# EAGLE design メイン2 (EAGLE 7.4.0)
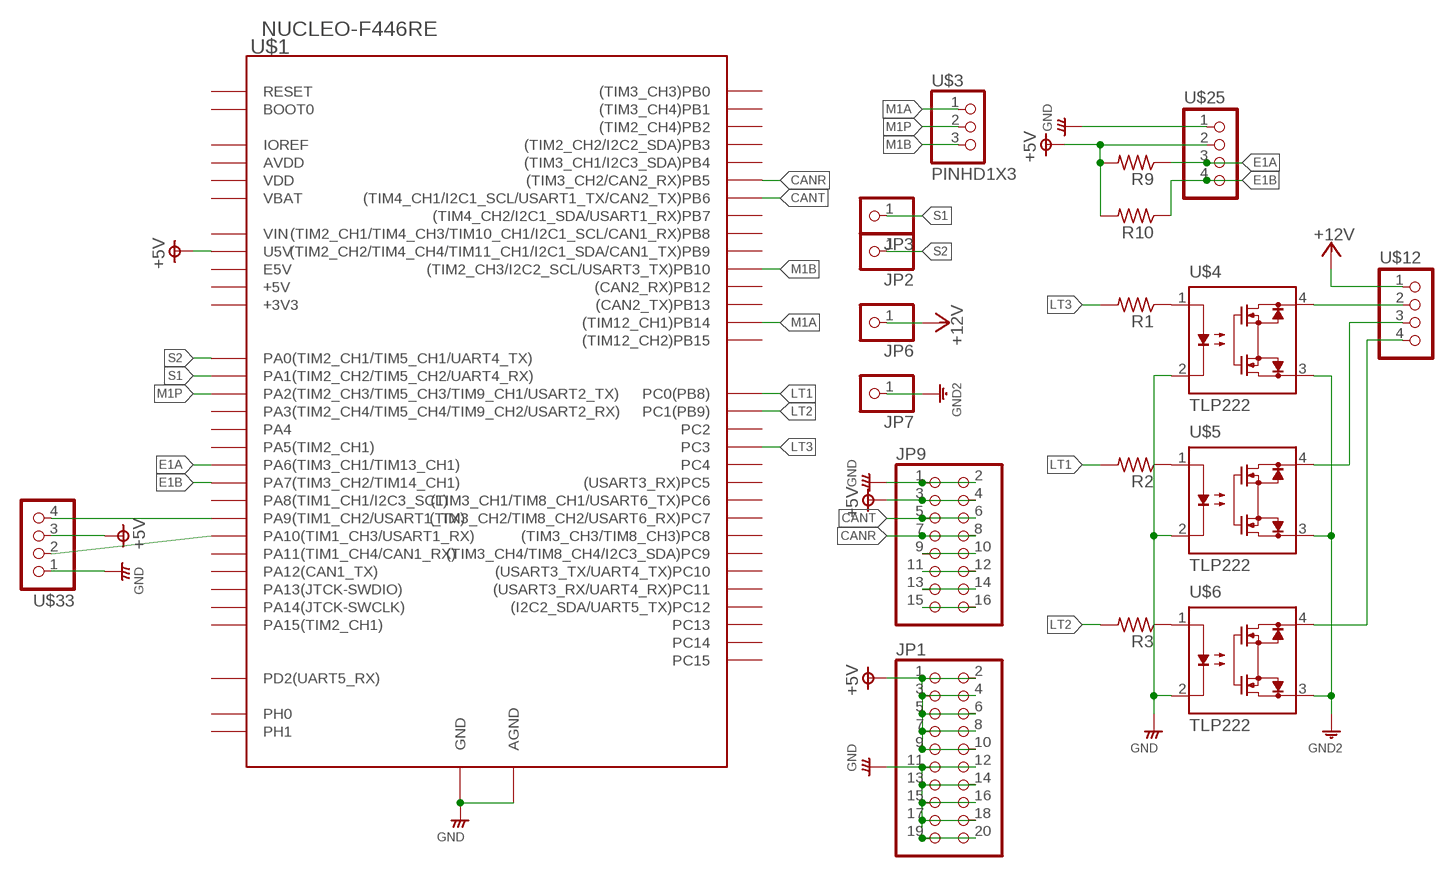
[diagram p0: schematic, sheet 1]

## Parts
JP1  PINHD-2X10  [2X10]
JP2  PINHD-1X1  [1X01]
JP3  PINHD-1X1  [1X01]
JP6  PINHD-1X1  [1X01]
JP7  PINHD-1X1  [1X01]
JP9  PINHD-2X8  [2X08]
R1  RESISTORS-3  [R_0.3]
R2  RESISTORS-3  [R_0.3]
R3  RESISTORS-3  [R_0.3]
R9  RESISTORS-3  [R_0.3]
R10  RESISTORS-3  [R_0.3]
U$1  NUCLEO-F446RE  [NUCLEO-F（L）ｘｘｘRｘ]
U$3  PINHD1X3  [1X3(XH)]
U$4  TLP222  [DIP4]
U$5  TLP222  [DIP4]
U$6  TLP222  [DIP4]
U$12  XH-PIN4  [XH-4PIN]
U$25  XH-PIN4  [XH-4PIN]
U$33  XH-PIN4  [XH-4PIN]

## Nets
+5V: JP1.1 JP1.2 JP1.3 JP1.4 JP1.5 JP1.6 JP1.7 JP1.8 JP1.9 JP1.10 JP9.3 JP9.4 R9.2 R10.2 U$1.U5V U$25.2 U$33.3
+12V: JP6.1 U$12.1
CANR: JP9.7 JP9.8 U$1.PB5((TIM3_CH2/CAN2_RX)PB5)
CANT: JP9.5 JP9.6 U$1.PB6((TIM4_CH1/I2C1_SCL/USART1_TX/CAN2_TX)PB6)
E1A: R9.1 U$1.PA6(PA6(TIM3_CH1/TIM13_CH1)) U$25.3
E1B: R10.1 U$1.PA7(PA7(TIM3_CH2/TIM14_CH1)) U$25.4
GND: JP1.11 JP1.12 JP1.13 JP1.14 JP1.15 JP1.16 JP1.17 JP1.18 JP1.19 JP1.20 JP9.1 JP9.2 U$1.AGND U$1.GND@1(GND) U$1.GND@2(GND) U$1.GND@3(GND) U$1.GND@4(GND) U$1.GND@5(GND) U$1.GND@6(GND) U$4.2(2CATHODE) U$5.2(2CATHODE) U$6.2(2CATHODE) U$25.1 U$33.1
GND12: JP7.1 U$4.3(3DRAIN) U$5.3(3DRAIN) U$6.3(3DRAIN) ; supply symbol labelled GND2
LT1: R2.2 U$1.PC0(PC0(PB8))
LT2: R3.2 U$1.PC1(PC1(PB9))
LT3: R1.2 U$1.PC3
M1A: U$1.PB14((TIM12_CH1)PB14) U$3.1
M1B: U$1.PB10((TIM2_CH3/I2C2_SCL/USART3_TX)PB10) U$3.3
M1P: U$1.PA2(PA2(TIM2_CH3/TIM5_CH3/TIM9_CH1/USART2_TX)) U$3.2
N$1: U$1.PA10(PA10(TIM1_CH3/USART1_RX)) U$33.2
N$3: U$1.PA9(PA9(TIM1_CH2/USART1_TX)) U$33.4
N$11: U$4.4(4DRAIN) U$12.2
N$12: U$5.4(4DRAIN) U$12.3
N$13: U$6.4(4DRAIN) U$12.4
N$19: JP9.9 JP9.10
N$20: JP9.11 JP9.12
N$21: JP9.13 JP9.14
N$22: JP9.15 JP9.16
N$39: R1.1 U$4.1(1ANODE)
N$40: R2.1 U$5.1(1ANODE)
N$41: R3.1 U$6.1(1ANODE)
S1: JP3.1 U$1.PA1(PA1(TIM2_CH2/TIM5_CH2/UART4_RX))
S2: JP2.1 U$1.PA0(PA0(TIM2_CH1/TIM5_CH1/UART4_TX))
Unconnected: U$1.+3V3 U$1.+5V U$1.AVDD U$1.BOOT0 U$1.E5V U$1.IOREF U$1.PA3(PA3(TIM2_CH4/TIM5_CH4/TIM9_CH2/USART2_RX)) U$1.PA4 U$1.PA5(PA5(TIM2_CH1)) U$1.PA8(PA8(TIM1_CH1/I2C3_SCL)) U$1.PA11(PA11(TIM1_CH4/CAN1_RX)) U$1.PA12(PA12(CAN1_TX)) U$1.PA13(PA13(JTCK-SWDIO)) U$1.PA14(PA14(JTCK-SWCLK)) U$1.PA15(PA15(TIM2_CH1)) U$1.PB0((TIM3_CH3)PB0) U$1.PB1((TIM3_CH4)PB1) U$1.PB2((TIM2_CH4)PB2) U$1.PB3((TIM2_CH2/I2C2_SDA)PB3) U$1.PB4((TIM3_CH1/I2C3_SDA)PB4) U$1.PB7((TIM4_CH2/I2C1_SDA/USART1_RX)PB7) U$1.PB8((TIM2_CH1/TIM4_CH3/TIM10_CH1/I2C1_SCL/CAN1_RX)PB8) U$1.PB9((TIM2_CH2/TIM4_CH4/TIM11_CH1/I2C1_SDA/CAN1_TX)PB9) U$1.PB12((CAN2_RX)PB12) U$1.PB13((CAN2_TX)PB13) U$1.PB15((TIM12_CH2)PB15) U$1.PC2 U$1.PC4 U$1.PC5((USART3_RX)PC5) U$1.PC6((TIM3_CH1/TIM8_CH1/USART6_TX)PC6) U$1.PC7((TIM3_CH2/TIM8_CH2/USART6_RX)PC7) U$1.PC8((TIM3_CH3/TIM8_CH3)PC8) U$1.PC9((TIM3_CH4/TIM8_CH4/I2C3_SDA)PC9) U$1.PC10((USART3_TX/UART4_TX)PC10) U$1.PC11((USART3_RX/UART4_RX)PC11) U$1.PC12((I2C2_SDA/UART5_TX)PC12) U$1.PC13 U$1.PC14 U$1.PC15 U$1.PD2(PD2(UART5_RX)) U$1.PH0 U$1.PH1 U$1.RESET U$1.VBAT U$1.VDD U$1.VIN

## Library data of the parts
JP1 = pinhead_s:PINHD-2X10: PIN HEADER
JP2 JP3 JP6 JP7 = pinhead_s:PINHD-1X1: PIN HEADER
JP9 = pinhead_s:PINHD-2X8: PIN HEADER
R1-R3 R9 R10 = rcl__s:RESISTORS
U$1 = STM32:NUCLEO-F446RE
U$3 = pinhead_s:PINHD1X3
U$4-U$6 = TLP222:TLP222
U$12 U$25 U$33 = xh-pin4:XH-PIN4: xh-pin4

## Board
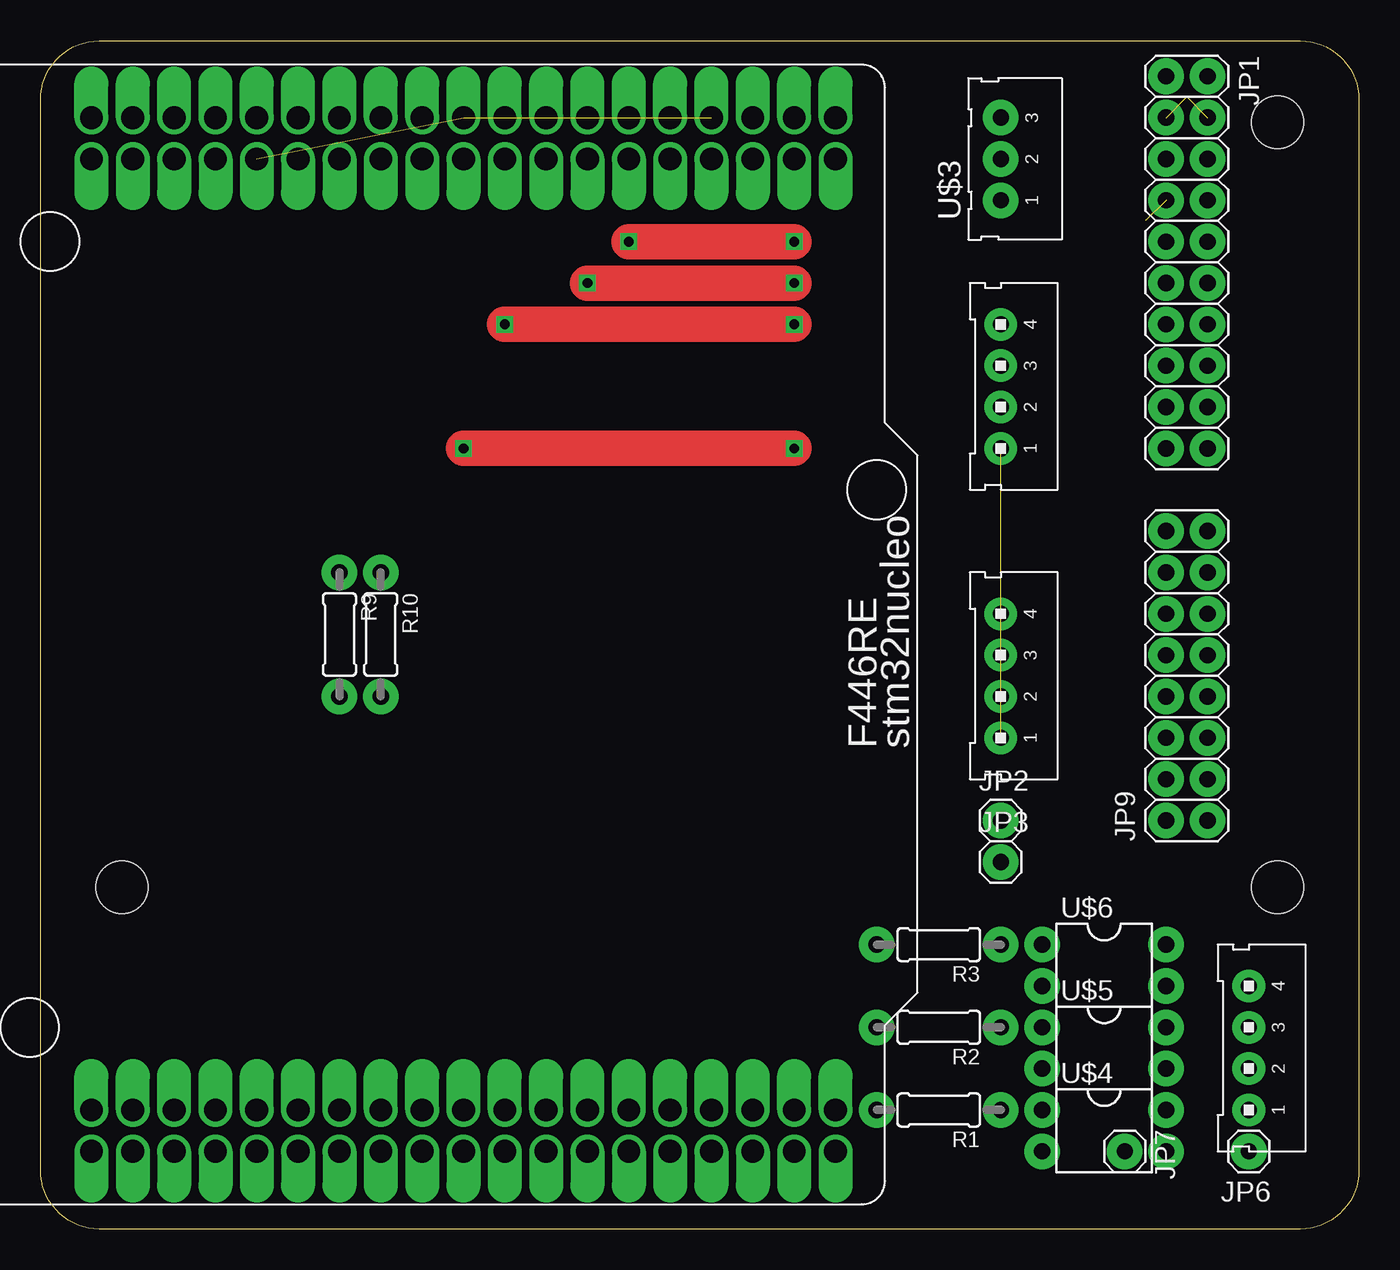
[diagram p1: board, top side]
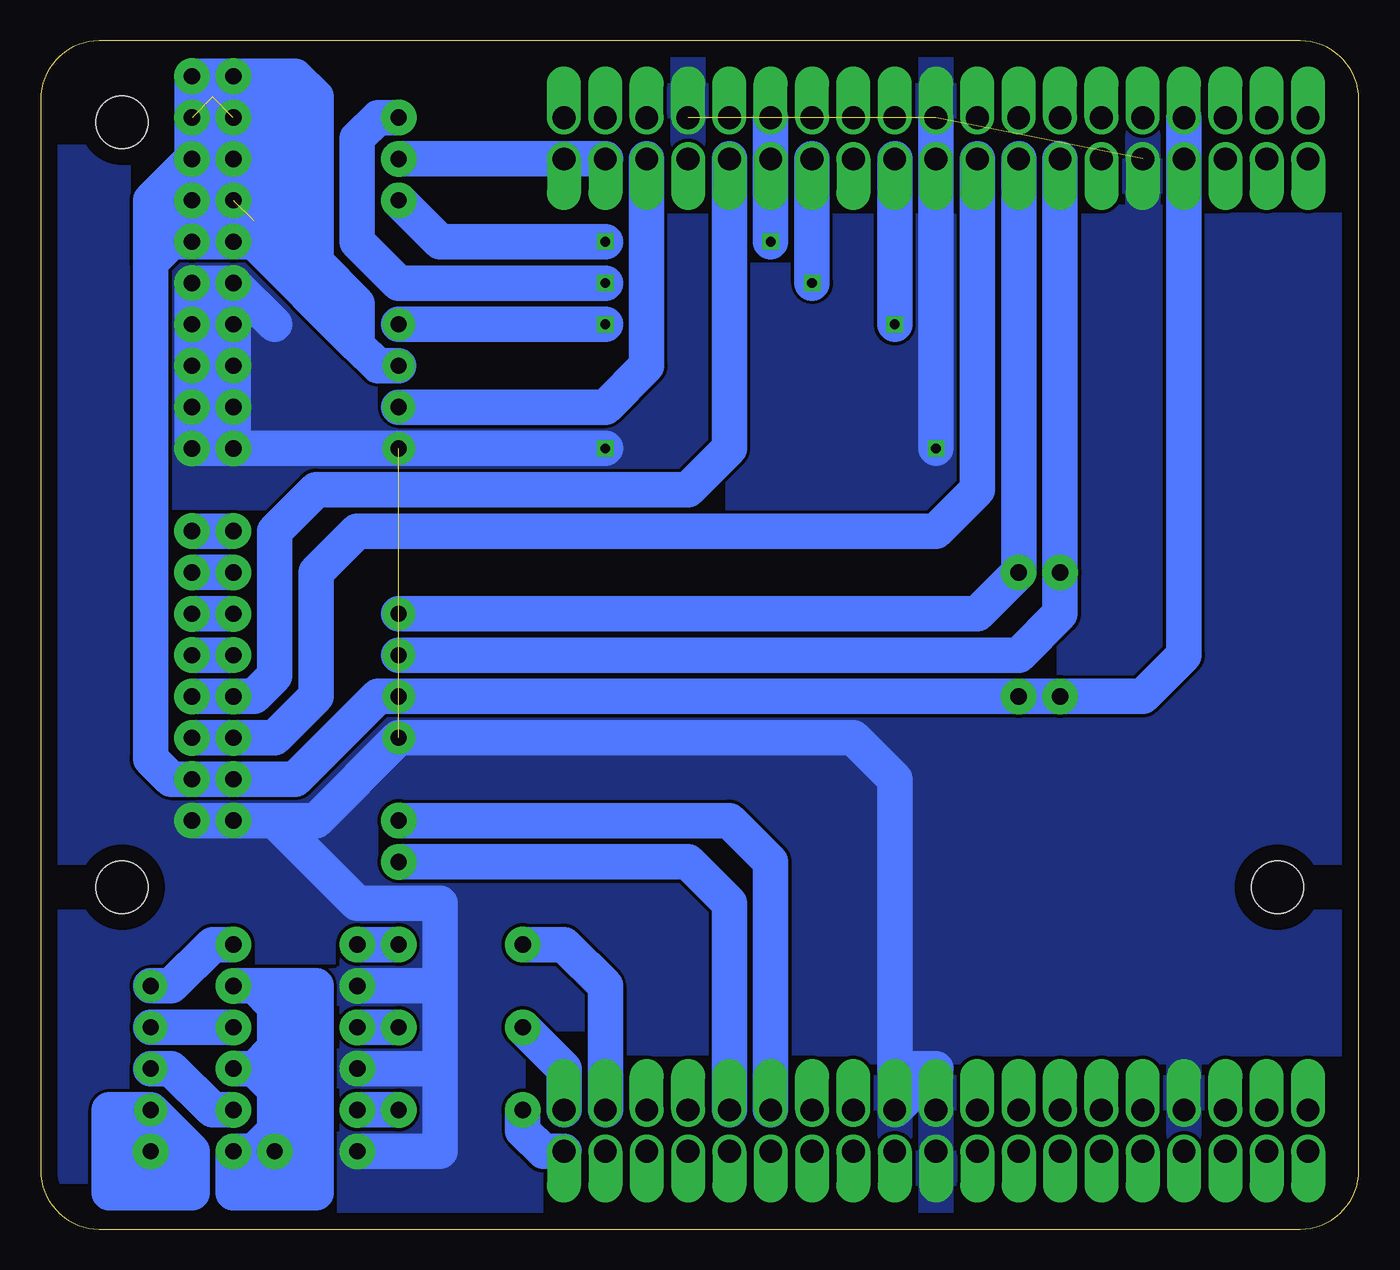
[diagram p2: board, bottom side, seen from below]

Size 81 x 73 mm. Coordinates in mm from the lower left corner, seen from the top.
Outline: 3.61,73 77.39,73 arc-90 81,69.39 81,3.61 arc-90 77.39,0 3.61,0 arc-90 0,3.61 0,69.39 arc-90 3.61,73
Copper layers (1*16): Top 0.035mm / dielectric 1.5mm / Bottom 0.035mm
Design rules "default": minimum track width 10mil, minimum drill 24mil, track to track 8mil, track to pad 8mil, pad to pad 8mil, via to via 8mil, smd to smd 8mil, copper to edge 40mil, drill to drill 8mil, minimum pad ring 10mil, minimum via ring 8mil, stop-mask expansion 4mil, vias tented up to drill 0mil, thermal gap 10mil
Holes 3.2 mm at 76,68 76,21 5,21

### Footprints (pad centres in the part's own frame; a part is rotated, then mirrored left to right if it is on the bottom)
2X10 = drill 1 pad 2.184: 1 -11.43,-1.27; 2 -11.43,1.27; 3 -8.89,-1.27; 4 -8.89,1.27; 5 -6.35,-1.27; 6 -6.35,1.27; 7 -3.81,-1.27; 8 -3.81,1.27; 9 -1.27,-1.27; 10 -1.27,1.27; 11 1.27,-1.27; 12 1.27,1.27; 13 3.81,-1.27; 14 3.81,1.27; 15 6.35,-1.27; 16 6.35,1.27; 17 8.89,-1.27; 18 8.89,1.27; 19 11.43,-1.27; 20 11.43,1.27
1X01 = drill 1 pad 2.184: 1 0,0
2X08 = drill 1 pad 2.184: 1 -8.89,-1.27; 2 -8.89,1.27; 3 -6.35,-1.27; 4 -6.35,1.27; 5 -3.81,-1.27; 6 -3.81,1.27; 7 -1.27,-1.27; 8 -1.27,1.27; 9 1.27,-1.27; 10 1.27,1.27; 11 3.81,-1.27; 12 3.81,1.27; 13 6.35,-1.27; 14 6.35,1.27; 15 8.89,-1.27; 16 8.89,1.27
R_0.3 = drill 1 pad 2.184: 1 -3.81,0; 2 3.81,0
NUCLEO-F（L）ｘｘｘRｘ = drill 1.4 offset: +3V3 -27.94,-2.54; +5V -27.94,-5.08; AGND 33.02,-22.86; AVDD 30.48,7.62; BOOT0 -30.48,7.62; E5V -27.94,10.16; GND@1 -27.94,7.62; GND@2 -30.48,-7.62; GND@3 -27.94,-7.62; GND@4 -27.94,-10.16; GND@5 33.02,-7.62; GND@6 30.48,5.08; IOREF -27.94,2.54; NC@1 -30.48,5.08; NC@2 -30.48,2.54; NC@3 -27.94,5.08; NC@4 -27.94,-15.24; NC@5 33.02,-30.48; NC@6 33.02,-27.94; NC@7 33.02,-5.08; NC@8 33.02,5.08; PA0 -27.94,-17.78; PA1 -27.94,-20.32; PA2 30.48,-27.94; PA3 30.48,-30.48; PA4 -27.94,-22.86; PA5 30.48,2.54; PA6 30.48,0; PA7 30.48,-2.54; PA8 30.48,-12.7; PA9 30.48,-10.16; PA10 30.48,-25.4; PA11 33.02,0; PA12 33.02,2.54; PA13 -30.48,0; PA14 -30.48,-2.54; PA15 -30.48,-5.08; PB0 -27.94,-25.4; PB1 33.02,-12.7; PB2 33.02,-10.16; PB3 30.48,-22.86; PB4 30.48,-17.78; PB5 30.48,-20.32; PB6 30.48,-5.08; PB7 -30.48,-10.16; PB8 30.48,12.7; PB9 30.48,10.16; PB10 30.48,-15.24; PB12 33.02,-2.54; PB13 33.02,-20.32; PB14 33.02,-17.78; PB15 33.02,-15.24; PC0 -27.94,-30.48; PC1 -27.94,-27.94; PC2 -30.48,-27.94; PC3 -30.48,-30.48; PC4 33.02,-25.4; PC5 33.02,10.16; PC6 33.02,12.7; PC7 30.48,-7.62; PC8 33.02,15.24; PC9 30.48,15.24; PC10 -30.48,15.24; PC11 -27.94,15.24; PC12 -30.48,12.7; PC13 -30.48,-12.7; PC14 -30.48,-15.24; PC15 -30.48,-17.78; PD2 -27.94,12.7; PH0 -30.48,-20.32; PH1 -30.48,-22.86; RESET -27.94,0; U5V 33.02,7.62; VBAT -30.48,-25.4; VDD -30.48,10.16; VIN -27.94,-12.7
1X3(XH) = drill 1 pad 2.184: 1 -2.54,0; 2 0,0; 3 2.54,0
DIP4 = drill 1 pad 2.184: 1 -1.27,-3.81; 2 1.27,-3.81; 3 1.27,3.81; 4 -1.27,3.81
XH-4PIN = drill 1 pad 2: 1 -5.08,0; 2 -2.54,0; 3 0,0; 4 2.54,0

### Placement (x,y rotation side)
JP1  70.43,59.39 270 top
JP2  59,25.1 0 top
JP3  59,22.56 0 top
JP6  74.24,4.78 180 top
JP7  66.62,4.78 270 top
JP9  70.43,33.99 90 top
R1  55.19,7.32 180 top
R2  55.19,12.4 180 top
R3  55.19,17.48 180 top
R9  18.36,36.53 270 top
R10  20.9,36.53 270 top
U$1  18.36,35.26 90 top
U$3  59,65.74 90 top
U$4  65.35,6.05 270 top
U$5  65.35,11.13 270 top
U$6  65.35,16.21 270 top
U$12  74.24,12.4 90 top
U$25  59,35.26 90 top
U$33  59,53.04 90 top

### Tracks (layer width: path | path; a pad name or v marks a point on that pad's centre or on a via)
+5V  (3 unrouted)
  Bottom 2.184: JP1.2 JP1.1 | JP1.1 JP1.5 JP1.9 | JP1.9 JP1.10 | U$1.U5V 10.74,35.26 13.28,32.72 R9.2 R10.2 U$25.2 60.27,32.72 65.35,27.64 JP9.4 JP9.3 72.97,27.64 74.24,28.91 74.24,59.39 | JP1.2 JP1.6 | JP1.6 JP1.10 | JP1.10 72.97,60.66 74.24,59.39 | U$33.3 60.27,53.04 61.54,54.31 | 61.54,54.31 67.89,60.66 JP1.9 | JP1.2 70.43,69.55 70.43,61.93 | JP1.1 67.89,70.82 | 67.89,70.82 66.62,70.82 | 66.62,70.82 65.35,70.82 64.08,69.55 64.08,59.39 61.54,56.85 61.54,54.31 | 66.62,70.82 66.62,69.55 | 66.62,69.55 65.35,68.28 65.35,60.66 | 65.35,59.39 65.35,60.66 | 65.35,60.66 66.62,61.93 66.62,69.55 | 66.62,69.55 67.89,70.82 | 67.89,70.82 67.89,61.93 | 74.24,59.39 74.24,60.66 | 74.24,60.66 74.24,63.2 JP1.6 | JP1.6 JP1.8 74.24,60.66
+12V
  Bottom 2.184: U$12.1 JP6.1 | U$12.1 71.7,4.78 71.7,2.24 76.78,2.24 76.78,7.32 U$12.1 | U$12.1 75.51,6.05 | 75.51,4.78 75.51,3.51 72.97,3.51 JP6.1 | JP6.1 75.51,6.05 | 75.51,6.05 75.51,4.78 | 75.51,4.78 JP6.1
CANR
  Bottom 2.184: JP9.7 JP9.8 67.89,32.72 66.62,33.99 66.62,42.88 64.08,45.42 41.22,45.42 38.68,47.96 U$1.PB5
CANT
  Bottom 2.184: JP9.5 JP9.6 66.62,30.18 64.08,32.72 64.08,40.34 61.54,42.88 25.98,42.88 23.44,45.42 U$1.PB6
E1A
  Bottom 2.184: U$1.PA6 R9.1 18.36,37.8 20.9,35.26 U$25.3
E1B
  Bottom 2.184: U$25.4 23.44,37.8 R10.1 U$1.PA7
GND  (via drill 0.6)  (3 unrouted)
  Top 2.184: v46.3,47.96 v25.98,47.96
  Bottom 2.184: JP1.19 JP1.17 JP1.15 JP1.11 | JP1.19 JP1.20 JP1.12 JP1.11 | JP9.2 JP9.1 | v46.3,47.96 U$33.1 JP1.19 | v25.98,47.96 U$1.GND@5 | U$6.2 56.46,14.94 | 56.46,14.94 56.46,9.86 | 56.46,9.86 U$5.2 | U$4.2 56.46,4.78 56.46,9.86 | JP9.2 64.08,25.1 U$25.1 31.06,30.18 28.52,27.64 28.52,9.86 | JP9.2 66.62,25.1 61.54,20.02 56.46,20.02 56.46,14.94 | 28.52,9.86 U$1.GND@4 25.98,9.86 28.52,9.86 | JP1.19 70.43,49.23 70.43,56.85 | JP1.11 66.62,55.58
  pour Bottom: 0.58,73.36 81.86,73.36 81.86,-0.3 0.58,-0.3
GND12
  Bottom 2.184: U$5.3 67.89,9.86 | 67.89,9.86 66.62,9.86 | 66.62,9.86 66.62,8.59 | 66.62,6.05 JP7.1 67.89,4.78 | 66.62,14.94 U$6.3 67.89,14.94 66.62,13.67 | 66.62,14.94 66.62,13.67 | 66.62,11.13 66.62,9.86 | 66.62,13.67 66.62,11.13 | 66.62,11.13 67.89,9.86 | 67.89,9.86 66.62,8.59 | 66.62,8.59 66.62,6.05 | 66.62,6.05 67.89,4.78 | 67.89,4.78 U$4.3 69.16,3.51 | 69.16,3.51 69.16,2.24 64.08,2.24 64.08,14.94 66.62,14.94 | 66.62,14.94 65.35,13.67 65.35,3.51 69.16,3.51
LT1
  Bottom 2.184: R2.2 48.84,9.86 U$1.PC0
LT2
  Bottom 2.184: R3.2 48.84,17.48 46.3,14.94 U$1.PC1
LT3
  Bottom 2.184: R1.2 51.38,6.05 50.11,4.78 U$1.PC3
M1A  (via drill 0.6)
  Top 2.184: v46.3,60.66 v36.14,60.66
  Bottom 2.184: U$3.1 56.46,60.66 v46.3,60.66 | v36.14,60.66 U$1.PB14
M1B  (via drill 0.6)
  Top 2.184: v46.3,58.12 v33.6,58.12
  Bottom 2.184: U$3.3 60.27,68.28 61.54,67.01 61.54,60.66 59,58.12 v46.3,58.12 | v33.6,58.12 U$1.PB10
M1P
  Bottom 2.184: U$3.2 U$1.PA2
N$1
  Bottom 2.184: U$33.2 46.3,50.5 43.76,53.04 U$1.PA10
N$3  (via drill 0.6)
  Top 2.184: v28.52,55.58 v46.3,55.58
  Bottom 2.184: 28.52,63.2 U$1.PA9 v28.52,55.58 | v46.3,55.58 U$33.4
N$11
  Bottom 2.184: U$4.4 70.43,7.32 72.97,9.86 U$12.2
N$12
  Bottom 2.184: U$5.4 U$12.3
N$13
  Bottom 2.184: U$6.4 70.43,17.48 72.97,14.94 U$12.4
N$19
  Bottom 2.184: JP9.10 JP9.9
N$20
  Bottom 2.184: JP9.12 JP9.11
N$21
  Bottom 2.184: JP9.14 JP9.13
N$22
  Bottom 2.184: JP9.16 JP9.15
N$39
  Bottom 2.184: U$4.1 R1.1
N$40
  Bottom 2.184: U$5.1 R2.1
N$41
  Bottom 2.184: R3.1 U$6.1
S1
  Bottom 2.184: JP3.1 41.22,22.56 38.68,20.02 U$1.PA1
S2
  Bottom 2.184: JP2.1 38.68,25.1 36.14,22.56 U$1.PA0